# Altium project IOT_STM32L412_sx1276_radio.PrjPcb
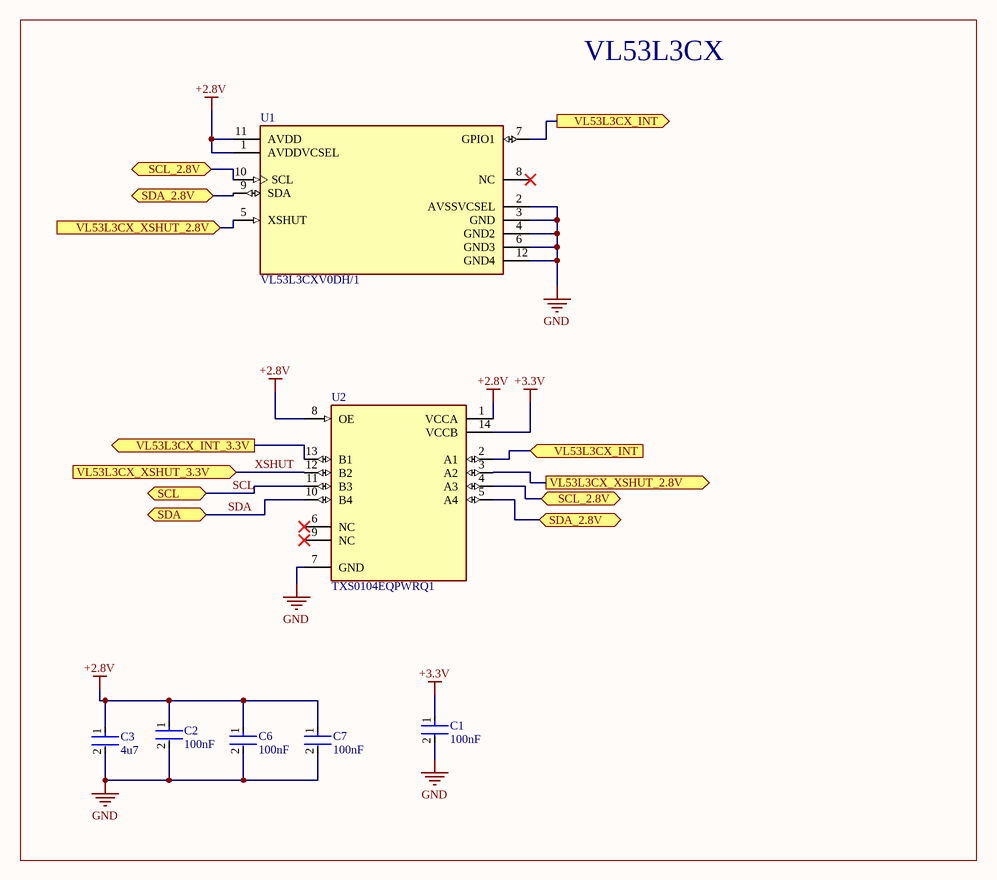
[diagram p0: VL53L3CX.SchDoc]
3 sheets, 33 parts. Net scope: flat (ports and power ports of the same name join across sheets).
Board file: IOT_DECETOR_PCB.PcbDoc
Sheets:
  VL53L3CX.SchDoc
  MCU.SchDoc
  RFM95.SchDoc

## Sheet VL53L3CX.SchDoc
size A4; SheetNumber: 2; SheetTotal: 6

### Parts
C1  100nF  [FP-C1206C-EB-MFG]
C2  100nF  [FP-C1206C-EB-MFG]
C3  4u7  [FP-GRM21B-0_15-MFG]
C6  100nF  [FP-C1206C-EB-MFG]
C7  100nF  [FP-C1206C-EB-MFG]
U1  VL53L3CXV0DH/1  [FP-LGA-12-DM00392521-MFG]
U2  TXS0104EQPWRQ1  [FP-PW0014A-IPC_C]

### Blocks framed on the sheet
VL53L3CX: C1-C3 C6 C7 U1 U2

### Ports
SCL (bidir, see MCU[2C], Sheet3[5A], Sheet3[6C]), SCL_2.8V (bidir, see Sheet3[6A], Sheet3[7A], VL53L3CX[1A]), SCL_2.8V (bidir, see Sheet3[6A], Sheet3[7A], VL53L3CX[2C]), SDA (bidir, see MCU[2C], Sheet3[5A], Sheet3[6C]), SDA_2.8V (bidir, see Sheet3[6A], Sheet3[7A], VL53L3CX[1A]), SDA_2.8V (bidir, see Sheet3[6A], Sheet3[7A], VL53L3CX[2C]), VL53L3CX_INT (in, see Sheet3[6A], Sheet3[8A], VL53L3CX[2A]), VL53L3CX_INT (out, see Sheet3[6A], Sheet3[8A], VL53L3CX[2B]), VL53L3CX_INT_3.3V (out, see MCU[3C], Sheet3[5A], Sheet3[7B]), VL53L3CX_XSHUT_2.8V (in, see Sheet3[6A], Sheet3[7A], VL53L3CX[2B]), VL53L3CX_XSHUT_2.8V (out, see Sheet3[6A], Sheet3[7A], VL53L3CX[1A]), VL53L3CX_XSHUT_3.3V (in, see MCU[2C], Sheet3[5A], Sheet3[6B])

### Nets
+2.8V: C2.1 C3.1 C6.1 C7.1 U1.1(AVDDVCSEL) U1.11(AVDD) U2.1(VCCA) U2.8(OE)
+3.3V: C1.1 U2.14(VCCB)
GND: C1.2 C2.2 C3.2 C6.2 C7.2 U1.2(AVSSVCSEL) U1.3(GND) U1.4(GND2) U1.6(GND3) U1.12(GND4) U2.7(GND)
SCL: U2.11(B3) ; port SCL
SDA: U2.10(B4) ; port SDA
XSHUT: U2.12(B2) ; port VL53L3CX_XSHUT_3.3V
NetU1_5: U1.5(XSHUT) U2.3(A2) ; port VL53L3CX_XSHUT_2.8V
NetU1_7: U1.7(GPIO1) U2.2(A1) ; port VL53L3CX_INT
NetU1_9: U1.9(SDA) U2.5(A4) ; port SDA_2.8V
NetU1_10: U1.10(SCL) U2.4(A3) ; port SCL_2.8V
NetU2_13: U2.13(B1) ; port VL53L3CX_INT_3.3V

Not connected (* = marked no-connect by the designer): U1 8(NC)*; U2 6(NC)* 9(NC)*

### Library data of the parts
C1 C2 C6 C7 = CMP-03020-021070-1: CAP CER 0.1UF 16V 10% X7R 1206; Manufacturer Part Number: C1206C104K4RACTU; Manufacturer: KEMET; Automotive Grade: Grade 0; Tolerance: 0.1; Temperature Coefficient: 15%; Capacitance: 0.10 μF; Material: Ceramic; Value: 0.10 μF; ComponentLink2URL: https://content.kemet.com/datasheets/KEM_C1007_X8R_ULTRA_150C_SMD.pdf; Voltage Rating: 16 V; Temperature Range Low: -55°C; Device Class L3: Ceramic Capacitors; Device Class L1: Passive Components; Lead Free: Yes; Temperature Characteristic: X7R; Package: C1206C-EB; RoHS: TRUE; Ipc Land Pattern Name: CAPC320160X78; Automotive: Yes; Temperature: -55°C to +150°C; Category: Cap; Digikey Description: CAP CER 0.1UF 16V 10% X7R 1206; Mouser Description: Multilayer Ceramic Capacitors MLCC - SMD/SMT 16volts 0.1uF X7R 10%; ComponentLink2Description: Datasheet; Temperature Range High: +150°C; Device Class L2: Capacitors; Height: 0.88mm; Octopart: https://octopart.com/c1206c104k4ractu-kemet-12577600
C3 = CMP-06035-005997-1: Chip Multilayer Ceramic Capacitors for General Purpose, 0805, 4.7uF, X7R, 15%, 10%, 10V; Tolerance: 10%; Capacitance: 4.7uF; Width: 1.25mm; Case/Package: 0805; Voltage Rating (DC): 10V; Thickness: 1.25mm; Dielectric: X7R; Length: 2mm
U1 = CMP-12178-000002-1: TIME-OF-FLIGHT PROXIMITY SENSOR
U2 = CMP-04899-000064-1: IC TRNSLTR BIDIRECTIONAL 14TSSOP; Min Supply Voltage: 1.65V; Quiescent Current: 14.4uA; Data Rate: 24Mbps; Logic Function: Translator; Number of Circuits: 1; Number of Bits: 4; Low Level Output Current: 1mA; Max Supply Voltage: 5.5V; High Level Output Current: -20uA; Operating Supply Current: 25uA; Propagation Delay: 4.6ns; Contact Plating: Gold; Package Quantity: 2000; Number of Pins: 14; Lead Free: Lead Free; Weight: 0.004949oz; Min Operating Temperature: -40°C; Number of Channels: 4; Packaging: Tape and Reel; Mount: Surface Mount; Max Operating Temperature: 125°C; Case/Package: TSSOP; Channel Type: Bidirectional; RoHS Compliant: Yes; Radiation Hardening: No

## Sheet MCU.SchDoc
size A4; SheetNumber: 3; SheetTotal: 6
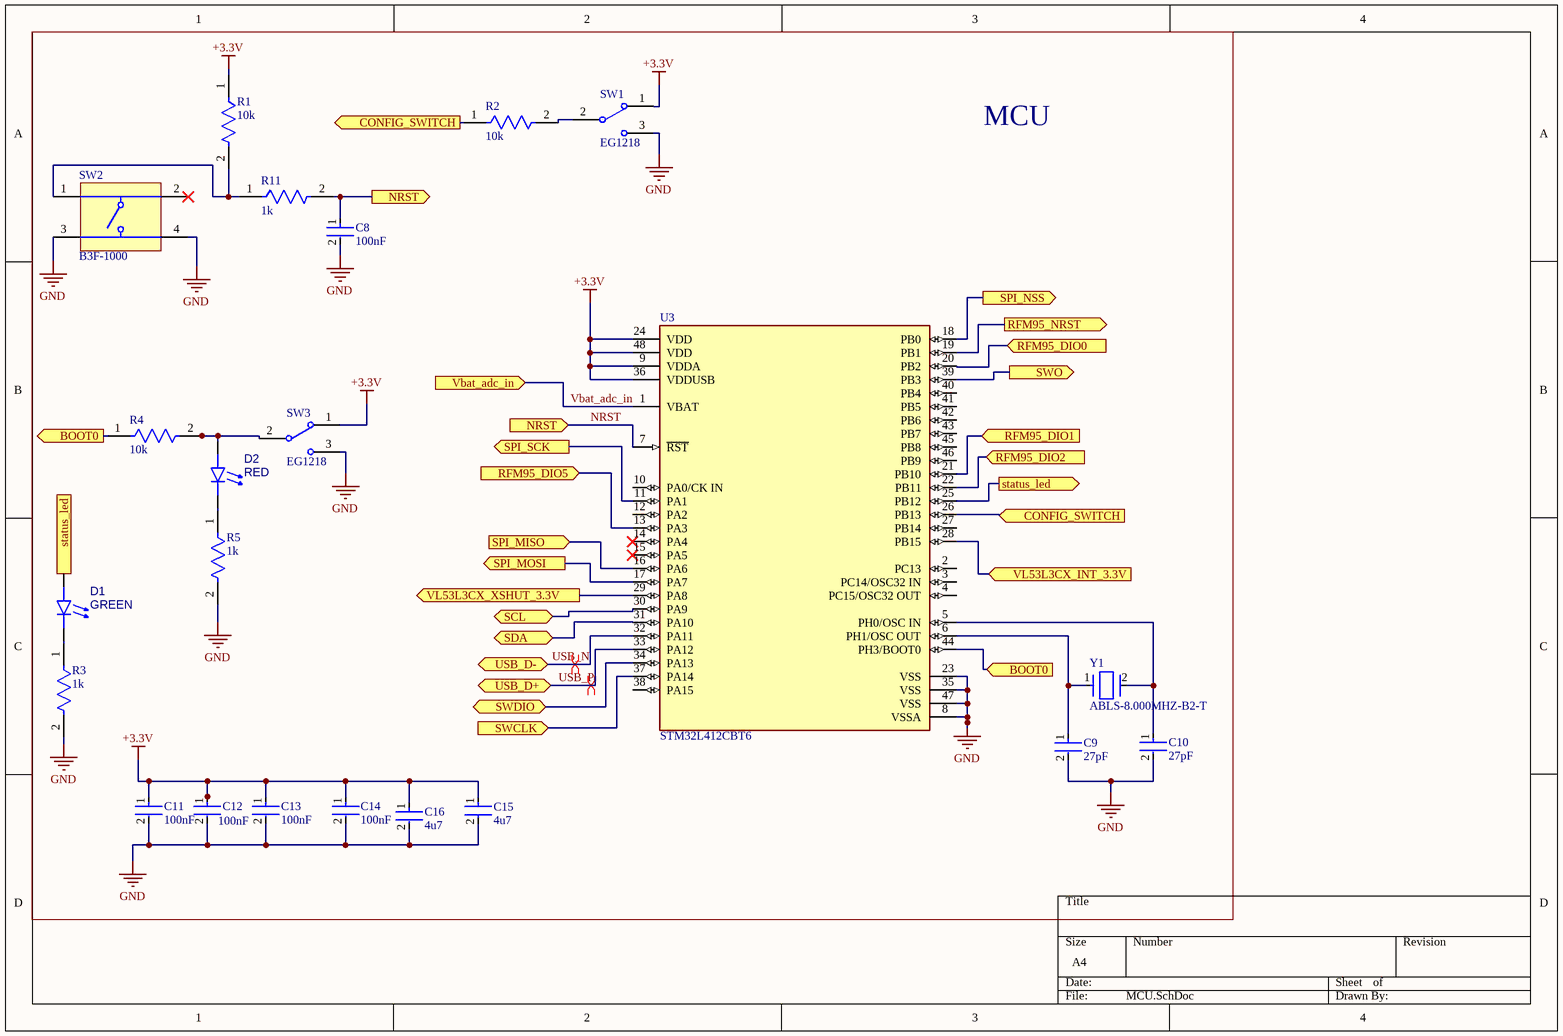
[diagram p1: MCU.SchDoc]

### Parts
C8  100nF  [FP-C1206C-EB-MFG]
C9  27pF  [FP-GCM31A-0_2-MFG]
C10  27pF  [FP-GCM31A-0_2-MFG]
C11  100nF  [FP-C1206C-EB-MFG]
C12  100nF  [FP-C1206C-EB-MFG]
C13  100nF  [FP-C1206C-EB-MFG]
C14  100nF  [FP-C1206C-EB-MFG]
C15  4u7  [FP-GRM21B-0_15-MFG]
C16  4u7  [FP-GRM21B-0_15-MFG]
D1  GREEN  [156120VS75000-Footprint-1]
D2  RED  [156120RS75000-Footprint-1]
R1  10k  [FP-RMCF1206-IPC_C]
R2  10k  [FP-RMCF1206-IPC_C]
R3  1k  [FP-RMCF1206-MFG]
R4  10k  [FP-RMCF1206-IPC_C]
R5  1k  [FP-RMCF1206-MFG]
R11  1k  [FP-RMCF1206-MFG]
SW1  EG1218  [ESWI-EG1218_V]
SW2  B3F-1000  [OMRON-B3F-1000-4_V]
SW3  EG1218  [ESWI-EG1218_V]
U3  STM32L412CBT6  [FP-LQFP48-5B-IPC_A]
Y1  ABLS-8.000MHZ-B2-T  [FP-ABLS-MFG]

### Blocks framed on the sheet
MCU: C8-C16 D1 D2 R1-R5 R11 SW1-SW3 U3 Y1

### Ports
BOOT0 (in, see MCU[1B], Sheet3[5C], Sheet3[7C]), BOOT0 (out, see MCU[3C], Sheet3[5C], Sheet3[7C]), CONFIG_SWITCH (in, see MCU[1A], Sheet3[6C], Sheet3[7B]), CONFIG_SWITCH (out, see MCU[3B], Sheet3[6C], Sheet3[7B]), NRST (in, see Connectors[3C], MCU[1A], Sheet3[3A], Sheet3[6B]), NRST (out, see Connectors[3C], MCU[2B], Sheet3[3A], Sheet3[6B]), RFM95_DIO0 (in, see RFM95[3A], Sheet3[2B], Sheet3[7B]), RFM95_DIO1 (in, see RFM95[3A], Sheet3[2B], Sheet3[7B]), RFM95_DIO2 (in, see RFM95[2A], Sheet3[2B], Sheet3[7B]), RFM95_DIO5 (in, see RFM95[2B], Sheet3[2B], Sheet3[6B]), RFM95_NRST (out, see RFM95[1A], Sheet3[1B], Sheet3[7B]), SCL (bidir, see Sheet3[5A], Sheet3[6C], VL53L3CX[1B]), SDA (bidir, see Sheet3[5A], Sheet3[6C], VL53L3CX[1C]), SPI_MISO (in, see RFM95[1B], Sheet3[1B], Sheet3[6B]), SPI_MOSI (out, see RFM95[1B], Sheet3[1B], Sheet3[6B]), SPI_NSS (out, see RFM95[1B], Sheet3[1B], Sheet3[7B]), SPI_SCK (out, see RFM95[1A], Sheet3[1B], Sheet3[6B]), status_led (in, see MCU[3B], Sheet3[5C], Sheet3[7B]), status_led (out, see MCU[1C], Sheet3[5C], Sheet3[7B]), SWCLK (in, see Connectors[3B], Sheet3[3A], Sheet3[6C]), SWDIO (bidir, see Connectors[3B], Sheet3[3A], Sheet3[6C]), SWO (out, see Connectors[3C], Sheet3[3A], Sheet3[7B]), USB_D+ (bidir, see Connectors[3C], Sheet3[3A], Sheet3[6C]), USB_D- (bidir, see Connectors[3B], Sheet3[3A], Sheet3[6C]), Vbat_adc_in (in, see Board_Power[2A], Sheet3[2A], Sheet3[6B]), VL53L3CX_INT_3.3V (in, see Sheet3[5A], Sheet3[7B], VL53L3CX[1B]), VL53L3CX_XSHUT_3.3V (out, see Sheet3[5A], Sheet3[6B], VL53L3CX[1B])

### Nets
+3.3V: C11.1 C12.1 C13.1 C14.1 C15.1 C16.1 R1.1 SW1.1 SW3.1 U3.9(VDDA) U3.24(VDD) U3.36(VDDUSB) U3.48(VDD)
GND: C8.2 C9.2 C10.2 C11.2 C12.2 C13.2 C14.2 C15.2 C16.2 R3.2 R5.2 SW1.3 SW2.3 SW2.4 SW3.3 U3.8(VSSA) U3.23(VSS) U3.35(VSS) U3.47(VSS)
DIO0: U3.20(PB2) ; port RFM95_DIO0
DIO1: U3.21(PB10) ; port RFM95_DIO1
DIO2: U3.22(PB11) ; port RFM95_DIO2
DIO5: U3.13(PA3) ; port RFM95_DIO5
MISO: U3.16(PA6) ; port SPI_MISO
MOSI: U3.17(PA7) ; port SPI_MOSI
NRST: C8.1 R11.2 U3.7(~{RST}) ; port NRST
NSS: U3.18(PB0) ; port SPI_NSS
RFM_NRST: U3.19(PB1) ; port RFM95_NRST
SCK: U3.11(PA1) ; port SPI_SCK
SCL: U3.30(PA9) ; port SCL
SDA: U3.31(PA10) ; port SDA
USB_N: U3.32(PA11) ; port USB_D-
USB_P: U3.33(PA12) ; port USB_D+
Vbat_adc_in: U3.1(VBAT) ; port Vbat_adc_in
XSHUT: U3.29(PA8) ; port VL53L3CX_XSHUT_3.3V
NetC9_1: C9.1 U3.6(PH1/OSC_OUT) Y1.1
NetC10_1: C10.1 U3.5(PH0/OSC_IN) Y1.2
NetD1_1: D1.1(K) R3.1
NetD1_2: D1.2(A) U3.25(PB12) ; port status_led
NetD2_1: D2.1(K) R5.1
NetD2_2: D2.2(A) R4.2 SW3.2(COM)
NetR1_2: R1.2 R11.1 SW2.1
NetR2_1: R2.1 U3.26(PB13) ; port CONFIG_SWITCH
NetR2_2: R2.2 SW1.2(COM)
NetR4_1: R4.1 U3.44(PH3/BOOT0) ; port BOOT0
NetU2_13: U3.28(PB15) ; port VL53L3CX_INT_3.3V
NetU3_34: U3.34(PA13) ; port SWDIO
NetU3_37: U3.37(PA14) ; port SWCLK
NetU3_39: U3.39(PB3) ; port SWO

Not connected (* = marked no-connect by the designer): SW2 2*; U3 2(PC13) 3(PC14/OSC32_IN) 4(PC15/OSC32_OUT) 10(PA0/CK_IN) 12(PA2) 14(PA4)* 15(PA5)* 27(PB14) 38(PA15) 40(PB4) 41(PB5) 42(PB6) 43(PB7) 45(PB8) 46(PB9)

### Layout directives
differential pair: USB_N, USB_P

### Library data of the parts
C8 C11-C14 = CMP-03020-021070-1: as C1 on sheet VL53L3CX; ComponentLink2URL: https://content.kemet.com/datasheets/KEM_C1007_X8R_ULTRA_150C_SMD.pdf; Voltage Rating: 16 V; Temperature Range Low: -55°C; Device Class L3: Ceramic Capacitors; Device Class L1: Passive Components; Lead Free: Yes; Temperature Characteristic: X7R; Package: C1206C-EB; RoHS: TRUE; Ipc Land Pattern Name: CAPC320160X78; Automotive: Yes; Temperature: -55°C to +150°C; Category: Cap; Digikey Description: CAP CER 0.1UF 16V 10% X7R 1206; Mouser Description: Multilayer Ceramic Capacitors MLCC - SMD/SMT 16volts 0.1uF X7R 10%; ComponentLink2Description: Datasheet; Temperature Range High: +150°C; Device Class L2: Capacitors; Height: 0.88mm; Octopart: https://octopart.com/c1206c104k4ractu-kemet-12577600
C9 C10 = CMP-06035-011656-1: Ceramic Capacitor for Automotive 27pF ±1% 1kVDC C0G 1206 Paper T/R
C15 C16 = CMP-06035-005997-1: as C3 on sheet VL53L3CX; Tolerance: 10%; Capacitance: 4.7uF; Width: 1.25mm; Case/Package: 0805; Voltage Rating (DC): 10V; Thickness: 1.25mm; Dielectric: X7R; Length: 2mm
D1 = CMP-007-00036-1: Single Color LED; RoHS Compliant: Yes
D2 = CMP-007-00037-1: Single Color LED; RoHS Compliant: Yes
R1 R2 R4 = CMP-26527-000061-1: 10kΩ ±5% 0.25W 1206 Thick Film Chip Resistor AEC-Q200 compliant; Resistance: 10kR; Power Rating: 250mW; Temperature Coefficient: 100ppm/°C; Case Code (Metric): 3216; Tolerance: 5%; Length: 3.2mm; Case Code (Imperial): 1206; Lead Free: Lead Free; Depth: 1.6mm; Min Operating Temperature: -55°C; Max Operating Temperature: 155°C; Series: RMCF; Mount: Surface Mount; Packaging: Tape and Reel; Construction: Rectangular; Width: 0.063inch; Number of Terminations: 2; Height: 0.028inch; Resistor Type: Thick Film; Features: Automotive AEC-Q200; Size Code: 1206; Contact Plating: Tin; Case/Package: 1206; RoHS Compliant: Yes; Military Standard: Not; Radiation Hardening: No; Max Power Dissipation: 250mW
R3 R5 R11 = CMP-26527-000044-1: 1kΩ ±5% 0.25W 1206 Thick Film Chip Resistor AEC-Q200 compliant; Temperature Coefficient: 200ppm/°C; Power Rating: 250mW; Working Voltage: 200V; Resistance: 1kR; Min Operating Temperature: -55°C; Mount: Surface Mount; Number of Terminations: 2; Case Code (Imperial): 1206; Case Code (Metric): 3216; Packaging: Tape and Reel; Tolerance: 5%; Height: 0.028inch; Length: 3.2mm; Features: Automotive AEC-Q200; Depth: 1.6mm; RoHS Compliant: Yes; Resistor Type: Thick Film; Width: 0.063inch; Lead Free: Lead Free; Max Power Dissipation: 250mW; Construction: Rectangular; Case/Package: 1206; Max Operating Temperature: 155°C; Contact Plating: Tin; Radiation Hardening: No; Series: RMCF; Military Standard: Not
SW1 SW3 = CMP-011-00006-2: Slide Switch, SPDT, 500 V, -20 to 70 degC, 3-Pin THD, RoHS, Bulk; Manufacturer: E-Switch; Voltage Rating (DC): 30V; Current Rating: 200mA; Operating Force: 250gf; Package Quantity: 1000; Contact Plating: Silver; Max Operating Temperature: 70°C; Min Operating Temperature: -20°C; Contact Material: Copper; Datasheet URL: https://www.e-switch.com/system/asset/product_line/data_sheet/119/EG.pdf; Contact Finish: Silver; Case/Package: EG1218; Voltage Rating (AC): 30V; Datasheet Version: Oct-15; Package Description: 3-Pin Through Hole Device, Body 11.6 x 4 mm, Pitch 2.5 mm; RoHS Compliant: True; Package Reference: EG1218; Manufacturer URL: http://www.e-switch.ch/en/; Throw Configuration: SPDT; Contact Current Rating: 200mA; Mounting Technology: TH; Packaging: Bulk; Pins: 3
SW2 = CMP-011-00004-2: Tactile Switch, SPST-NO, 0.05 A, 24 V, -25 to 70 degC, 4-Pin THD, RoHS, Bulk; Manufacturer: Omron Electronic Components; Throw Configuration: SPST; Max Contact Resistance: 100mohm; Resistance: 0.1Ohm; Max Current Rating: 50mA; Voltage Rating: 24V; Operating Force: 100gf; Datasheet Version: Jan-15; Case/Package: B3F-1000; Packaging: Bulk; Package Description: 4-Pin Through Hole Device, Body 6 x 6 mm; Manufacturer URL: http://www.omron.com/; Package Reference: B3F-1000; Contact Plating: Gold; Contact Current Rating: 50mA; RoHS Compliant: True; Contact Material: Gold; Mounting Technology: TH; Max Operating Temperature: 70°C; Min Operating Temperature: -25°C; Package Quantity: 1500; Datasheet URL: http://www.omron.com/ecb/products/pdf/en-b3f.pdf; Voltage Rating (DC): 24V; Pins: 4; Current Rating: 50mA; Max Voltage Rating (DC): 24V
U3 = CMP-12105-000110-1: IC MCU 32BIT 128KB FLASH 48LQFP; RoHS Compliant: Yes
Y1 = CMP-27762-009874-1: CRYSTAL 8.0000MHZ 18PF SMD; ESR (Equivalent Series Resistance): 80R; Operating Frequency: 8 MHz; Frequency Stability: 50ppm; Tolerance: 20ppm; Frequency: 8MHz; Min Operating Temperature: -20°C; Lead Free: Lead Free; Width: 4.7mm; Packaging: Tape and Reel; Series: ABLS; Accuracy: 20ppm; Length: 11.4mm; Frequency Tolerance: 20ppm; Termination: SMD/SMT; Number of Pins: 2; Radiation Hardening: No; Depth: 4.7mm; REACH SVHC: No SVHC; Contact Plating: Tin; Load Capacitance: 18pF; Case/Package: SMD/SMT; Mount: Surface Mount; Package Quantity: 1000; Max Operating Temperature: 70°C; Height: 0.165inch; Series Resistance: 80R

## Sheet RFM95.SchDoc
size A4; SheetNumber: 5; SheetTotal: 6
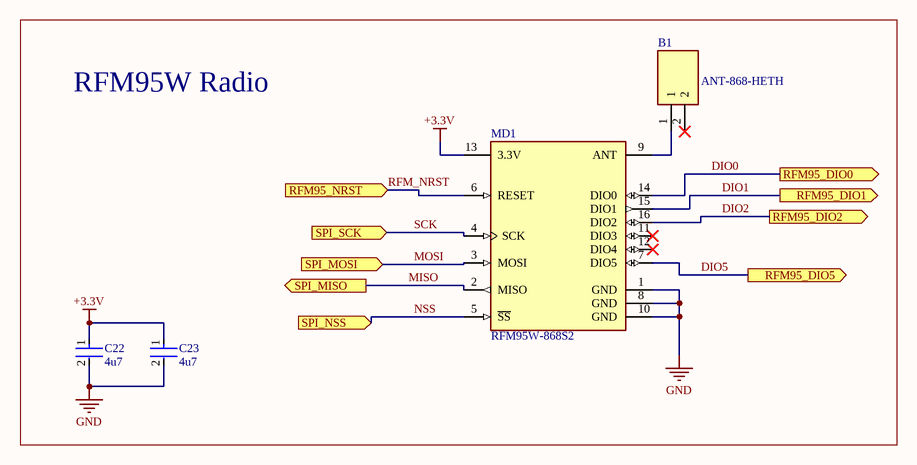
[diagram p2: RFM95.SchDoc]

### Parts
B1  ANT-868-HETH  [ANT-868-HETH-Footprint-1]
C22  4u7  [FP-GRM21B-0_15-MFG]
C23  4u7  [FP-GRM21B-0_15-MFG]
MD1  RFM95W-868S2  [FP-RFM95W-868S2-MFG]

### Blocks framed on the sheet
RFM95W Radio: B1 C22 C23 MD1

### Ports
RFM95_DIO0 (out, see MCU[4A], Sheet3[2B], Sheet3[7B]), RFM95_DIO1 (out, see MCU[4A], Sheet3[2B], Sheet3[7B]), RFM95_DIO2 (out, see MCU[4A], Sheet3[2B], Sheet3[7B]), RFM95_DIO5 (out, see MCU[2A], Sheet3[2B], Sheet3[6B]), RFM95_NRST (in, see MCU[4A], Sheet3[1B], Sheet3[7B]), SPI_MISO (out, see MCU[2B], Sheet3[1B], Sheet3[6B]), SPI_MOSI (in, see MCU[2B], Sheet3[1B], Sheet3[6B]), SPI_NSS (in, see MCU[4A], Sheet3[1B], Sheet3[7B]), SPI_SCK (in, see MCU[3A], Sheet3[1B], Sheet3[6B])

### Nets
+3.3V: C22.1 C23.1 MD1.13(3.3V)
GND: C22.2 C23.2 MD1.1(GND) MD1.8(GND) MD1.10(GND)
DIO0: MD1.14(DIO0) ; port RFM95_DIO0
DIO1: MD1.15(DIO1) ; port RFM95_DIO1
DIO2: MD1.16(DIO2) ; port RFM95_DIO2
DIO5: MD1.7(DIO5) ; port RFM95_DIO5
MISO: MD1.2(MISO) ; port SPI_MISO
MOSI: MD1.3(MOSI) ; port SPI_MOSI
NSS: MD1.5(~{SS}) ; port SPI_NSS
RFM_NRST: MD1.6(RESET) ; port RFM95_NRST
SCK: MD1.4(SCK) ; port SPI_SCK
NetB1_1: B1.1 MD1.9(ANT)

Not connected (* = marked no-connect by the designer): B1 2*; MD1 11(DIO3)* 12(DIO4)*

### Library data of the parts
B1 = CMP-00030-00001-2: RF/Microwave Antenna
C22 C23 = CMP-06035-005997-1: as C3 on sheet VL53L3CX; Tolerance: 10%; Capacitance: 4.7uF; Width: 1.25mm; Case/Package: 0805; Voltage Rating (DC): 10V; Thickness: 1.25mm; Dielectric: X7R; Length: 2mm
MD1 = CMP-204316-000001-1: RX TXRX MODULE ISM < 1GHZ SMD; Data Rate: 300Kbps; Frequency: 868MHz; Sensitivity: -123dBm; Interface: SPI; Current - Transmitting: 120mA; Current - Receiving: 12.1mA; Max Operating Temperature: 70°C; Case/Package: SMD/SMT; Packaging: Bulk; Mount: Surface Mount; Min Operating Temperature: -20°C

## Nets that join several sheets
+3.3V: VL53L3CX (C1.1 U2.14), MCU (13 pins), RFM95 (C22.1 C23.1 MD1.13)
GND: VL53L3CX (11 pins), MCU (19 pins), RFM95 (5 pins)
DIO0: MCU (U3.20), RFM95 (MD1.14)
DIO1: MCU (U3.21), RFM95 (MD1.15)
DIO2: MCU (U3.22), RFM95 (MD1.16)
DIO5: MCU (U3.13), RFM95 (MD1.7)
MISO: MCU (U3.16), RFM95 (MD1.2)
MOSI: MCU (U3.17), RFM95 (MD1.3)
NetU2_13: VL53L3CX (U2.13), MCU (U3.28)
NSS: MCU (U3.18), RFM95 (MD1.5)
RFM_NRST: MCU (U3.19), RFM95 (MD1.6)
SCK: MCU (U3.11), RFM95 (MD1.4)
SCL: VL53L3CX (U2.11), MCU (U3.30)
SDA: VL53L3CX (U2.10), MCU (U3.31)
XSHUT: VL53L3CX (U2.12), MCU (U3.29)